# Altium project UCLA-DRS4-2.1.PrjPCB (part 8 of 10)

## Sheet MARS_GPIO_MISC.SchDoc: My title
size A3; Organization: University of California; Address1: 475 Portola Plaza; Address2: Los Angeles, CA 90095; DocumentNumber: 27; Revision: R01; SheetNumber: 27; SheetTotal: 35
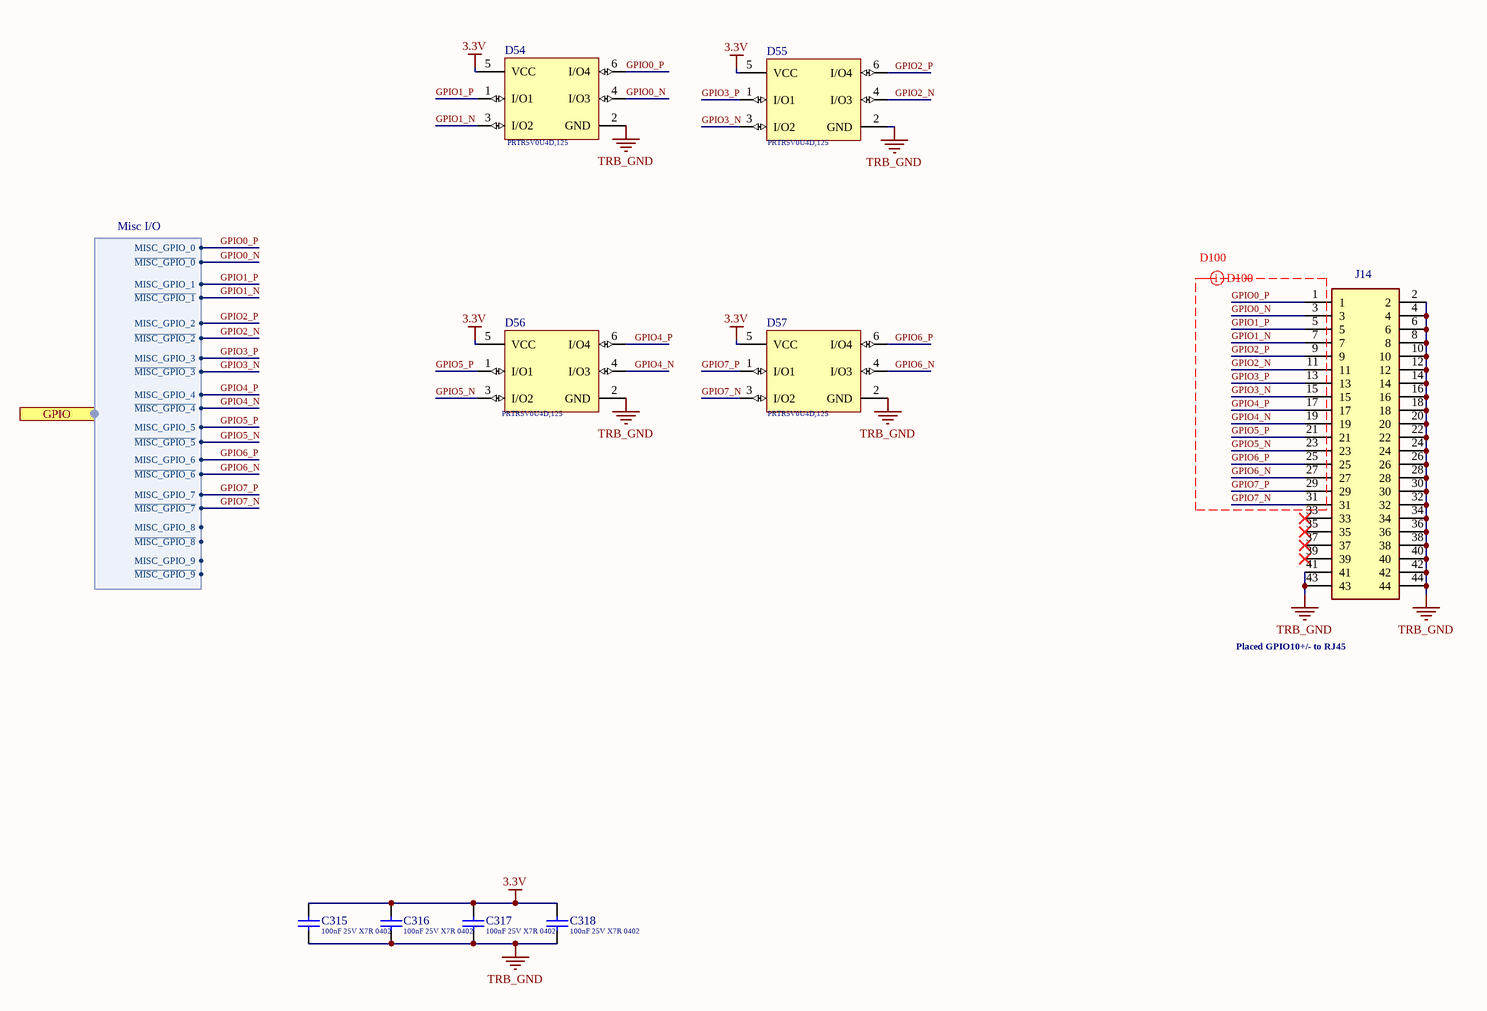
[diagram p24: MARS_GPIO_MISC.SchDoc]

### Parts
C315  Capacitance: 100nF 25V X7R 0402  [Cap_Taiyo_Yuden_TMK105B7104KV-FR_100nF]  (hidden comment: Cap_Taiyo_Yuden_TMK105B7104KV-FR_100nF)
C316  Capacitance: 100nF 25V X7R 0402  [Cap_Taiyo_Yuden_TMK105B7104KV-FR_100nF]  (hidden comment: Cap_Taiyo_Yuden_TMK105B7104KV-FR_100nF)
C317  Capacitance: 100nF 25V X7R 0402  [Cap_Taiyo_Yuden_TMK105B7104KV-FR_100nF]  (hidden comment: Cap_Taiyo_Yuden_TMK105B7104KV-FR_100nF)
C318  Capacitance: 100nF 25V X7R 0402  [Cap_Taiyo_Yuden_TMK105B7104KV-FR_100nF]  (hidden comment: Cap_Taiyo_Yuden_TMK105B7104KV-FR_100nF)
D54  PRTR5V0U4D,125  [PRTR5V0U4D,125]
D55  PRTR5V0U4D,125  [PRTR5V0U4D,125]
D56  PRTR5V0U4D,125  [PRTR5V0U4D,125]
D57  PRTR5V0U4D,125  [PRTR5V0U4D,125]
J14  10-89-7442  [HDRV44W87P254_2X22_5601X508X864P]  (value not drawn)

### Ports
GPIO (harness Misc I/O)

### Harnesses
Misc I/O: MISC_GPIO_0, ~{MISC_GPIO_0}, MISC_GPIO_1, ~{MISC_GPIO_1}, MISC_GPIO_2, ~{MISC_GPIO_2}, MISC_GPIO_3, ~{MISC_GPIO_3}, MISC_GPIO_4, ~{MISC_GPIO_4}, MISC_GPIO_5, ~{MISC_GPIO_5}, MISC_GPIO_6, ~{MISC_GPIO_6}, MISC_GPIO_7, ~{MISC_GPIO_7}, MISC_GPIO_8, ~{MISC_GPIO_8}, MISC_GPIO_9, ~{MISC_GPIO_9}

### Nets
3.3V: C315.2 C316.2 C317.2 C318.2 D54.5(VCC) D55.5(VCC) D56.5(VCC) D57.5(VCC)
TRB_GND: C315.1 C316.1 C317.1 C318.1 D54.2(GND) D55.2(GND) D56.2(GND) D57.2(GND) J14.2 J14.4 J14.6 J14.8 J14.10 J14.12 J14.14 J14.16 J14.18 J14.20 J14.22 J14.24 J14.26 J14.28 J14.30 J14.32 J14.34 J14.36 J14.38 J14.40 J14.41 J14.42 J14.43 J14.44
GPIO0_N: D54.4(I/O3) J14.3 ; port GPIO.~{MISC_GPIO_0}
GPIO0_P: D54.6(I/O4) J14.1 ; port GPIO.MISC_GPIO_0
GPIO1_N: D54.3(I/O2) J14.7 ; port GPIO.~{MISC_GPIO_1}
GPIO1_P: D54.1(I/O1) J14.5 ; port GPIO.MISC_GPIO_1
GPIO2_N: D55.4(I/O3) J14.11 ; port GPIO.~{MISC_GPIO_2}
GPIO2_P: D55.6(I/O4) J14.9 ; port GPIO.MISC_GPIO_2
GPIO3_N: D55.3(I/O2) J14.15 ; port GPIO.~{MISC_GPIO_3}
GPIO3_P: D55.1(I/O1) J14.13 ; port GPIO.MISC_GPIO_3
GPIO4_N: D56.4(I/O3) J14.19 ; port GPIO.~{MISC_GPIO_4}
GPIO4_P: D56.6(I/O4) J14.17 ; port GPIO.MISC_GPIO_4
GPIO5_N: D56.3(I/O2) J14.23 ; port GPIO.~{MISC_GPIO_5}
GPIO5_P: D56.1(I/O1) J14.21 ; port GPIO.MISC_GPIO_5
GPIO6_N: D57.4(I/O3) J14.27 ; port GPIO.~{MISC_GPIO_6}
GPIO6_P: D57.6(I/O4) J14.25 ; port GPIO.MISC_GPIO_6
GPIO7_N: D57.3(I/O2) J14.31 ; port GPIO.~{MISC_GPIO_7}
GPIO7_P: D57.1(I/O1) J14.29 ; port GPIO.MISC_GPIO_7

Not connected (* = marked no-connect by the designer): J14 33* 35* 37* 39*

### Layout directives
differential pair; differential pair class D100: GPIO0_N, GPIO0_P, GPIO1_N, GPIO1_P, GPIO2_N, GPIO2_P, GPIO3_N, GPIO3_P, GPIO4_N, GPIO4_P, GPIO5_N, GPIO5_P, GPIO6_N, GPIO6_P, GPIO7_N, GPIO7_P

### Notes on the sheet
- D100
- Placed GPIO10+/- to RJ45
- 475 Portola Plaza
- GAPS TOF
- igarcia91@g.ucla.edu
- Los Angeles, CA
- 310-825-0344
- Size:
- Date:
- Letter
- Revision:
- Time:
- Sheet
- of
- andrew.peck@cern.ch
- spq@ucla.edu
- File:

### Library data of the parts
C315-C318 = Cap_Taiyo_Yuden_TMK105B7104KV-FR_100nF: CAP CER 100nF 25V X7R 0402; Supplier 1: Mouser; Supplier Part Number 1: 963-TMK105B7104KV-FR
D54-D57 = PRTR5V0U4D,125: ESD Suppressors / TVS Diodes 5.5V QUAD R-R ESD ULTRA LOW CAP; Supplier 1: Mouser; Supplier Part Number 1: 771-PRTR5V0U4D-T/R
J14 = 10-89-7442: Connector; Manufacturer_Name: Molex; Datasheet Link: https://componentsearchengine.com//10-89-7442.pdf; Height: 8.64mm; Mouser2 Part Number: 538-10-89-7442; Mouser2 Price/Stock: https://www.mouser.com/Search/Refine.aspx?Keyword=538-10-89-7442; Manufacturer_Part_Number: 10-89-7442

## Sheet MARS_FTDI.SchDoc: My title
size A3; Organization: University of California; Address1: 475 Portola Plaza; Address2: Los Angeles, CA 90095; DocumentNumber: 18; Revision: R01; SheetNumber: 18; SheetTotal: 35
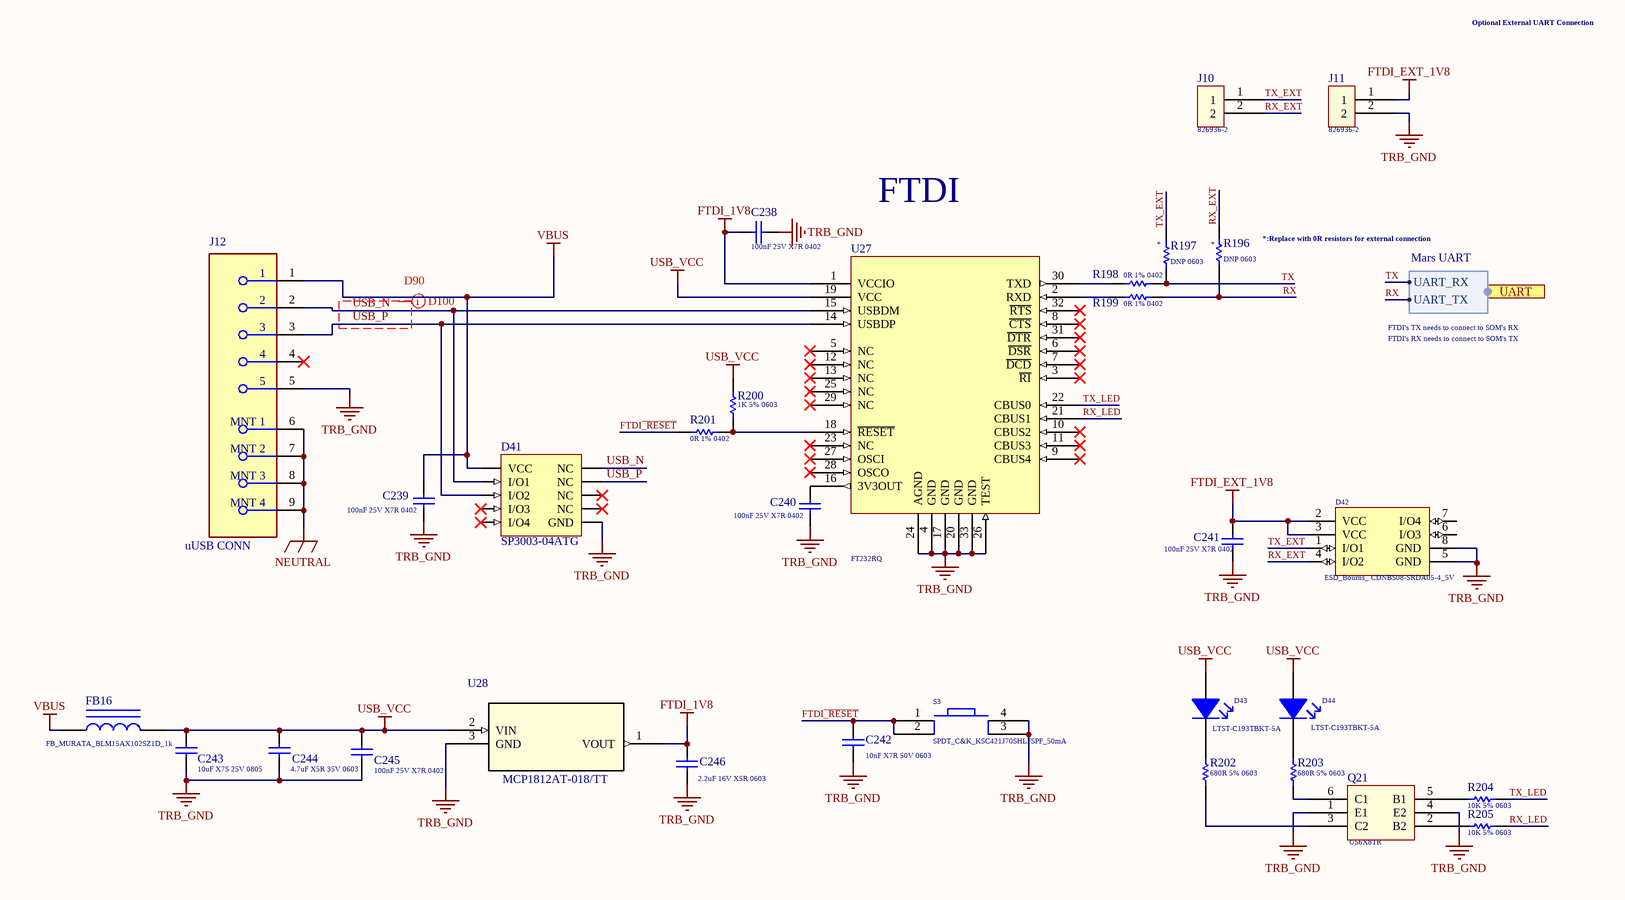
[diagram p25: MARS_FTDI.SchDoc]

### Parts
C238  Capacitance: 100nF 25V X7R 0402  [Cap_Taiyo_Yuden_TMK105B7104KV-FR_100nF]  (hidden comment: Cap_Taiyo_Yuden_TMK105B7104KV-FR_100nF)
C239  Capacitance: 100nF 25V X7R 0402  [Cap_Taiyo_Yuden_TMK105B7104KV-FR_100nF]  (hidden comment: Cap_Taiyo_Yuden_TMK105B7104KV-FR_100nF)
C240  Capacitance: 100nF 25V X7R 0402  [Cap_Taiyo_Yuden_TMK105B7104KV-FR_100nF]  (hidden comment: Cap_Taiyo_Yuden_TMK105B7104KV-FR_100nF)
C241  Capacitance: 100nF 25V X7R 0402  [Cap_Taiyo_Yuden_TMK105B7104KV-FR_100nF]  (hidden comment: Cap_Taiyo_Yuden_TMK105B7104KV-FR_100nF)
C242  Capacitance: 10nF X7R 50V 0603  [Kemet_C0603_0]  (hidden comment: Cap_Kemet_C0603C103J5RACTU_eec)
C243  Capacitance: 10uF X7S 25V 0805  [Cap_Murata_ GRM21BC71E106ME11L_10uF]  (hidden comment: Cap_Murata_ GRM21BC71E106ME11L_10uF)
C244  Capacitance: 4.7uF X5R 35V 0603  [Cap_Murata_ZRB18AR6YA475ME05L_4.7uF]  (hidden comment: Cap_Murata_ZRB18AR6YA475ME05L_4.7uF)
C245  Capacitance: 100nF 25V X7R 0402  [Cap_Taiyo_Yuden_TMK105B7104KV-FR_100nF]  (hidden comment: Cap_Taiyo_Yuden_TMK105B7104KV-FR_100nF)
C246  Capacitance: 2.2uF 16V X5R 0603  [CAPC0603(1608)100_L]  (hidden comment: Cap_Taiyo_Yuden_2.2uF)
D41  Series: SP3003-04ATG  [Diode_SP3003-04ATG_LVDS_ESD]  (hidden comment: Diode_SP3003-04ATG_LVDS_ESD)
D42  ESD_Bourns_ CDNBS08-SRDA05-4_5V  [ESD_Bourns_ CDNBS08-SRDA05-4_5V]
D43  Series: LTST-C193TBKT-5A  [Led_Lite-On_LTST-C193TBKT-5A_Blue]  (hidden comment: Led_Lite-On_LTST-C193TBKT-5A_Blue)
D44  Series: LTST-C193TBKT-5A  [Led_Lite-On_LTST-C193TBKT-5A_Blue]  (hidden comment: Led_Lite-On_LTST-C193TBKT-5A_Blue)
FB16  FB_MURATA_BLM15AX102SZ1D_1k  [FB_MURATA_BLM15AX102SZ1D_1k]
J10  Series: 826936-2  [Header_TE_Connectivity_826936-2_2POS_5A]  (hidden comment: Header_TE_Connectivity_826936-2_2POS_5A)
J11  Series: 826936-2  [Header_TE_Connectivity_826936-2_2POS_5A]  (hidden comment: Header_TE_Connectivity_826936-2_2POS_5A)
J12  uUSB CONN  [Wurth_Electronics_629105150521_MFG]
Q21  Series: US6X8TR  [BJT_ROHM_US6X8TR_1A_NPN]  (hidden comment: BJT_ROHM_US6X8TR_1A_NPN)
R196  Resistance: DNP 0603  [RES_DNP_0603]  (hidden comment: RES_DNP_0603)
R197  Resistance: DNP 0603  [RES_DNP_0603]  (hidden comment: RES_DNP_0603)
R198  Resistance: 0R 1% 0402  [Res_Vishay_CRCW04020000Z0EDC_0_Ohm]  (hidden comment: Res_Vishay_CRCW04020000Z0EDC_0_Ohm)
R199  Resistance: 0R 1% 0402  [Res_Vishay_CRCW04020000Z0EDC_0_Ohm]  (hidden comment: Res_Vishay_CRCW04020000Z0EDC_0_Ohm)
R200  1K 5% 0603  [RESC0603(1608)_L]
R201  Resistance: 0R 1% 0402  [Res_Vishay_CRCW04020000Z0EDC_0_Ohm]  (hidden comment: Res_Vishay_CRCW04020000Z0EDC_0_Ohm)
R202  680R 5% 0603  [RESC0603(1608)_L]
R203  680R 5% 0603  [RESC0603(1608)_L]
R204  10K 5% 0603  [RESC0603(1608)_L]
R205  10K 5% 0603  [RESC0603(1608)_L]
S3  SPDT_C&K_KSC421J70SHLFSPF_50mA  [SPDT_C&K_KSC421J70SHLFSPF_50mA]
U27  Series: FT232RQ  [IC_FTDI_FT232RQ-REEL]  (hidden comment: IC_FTDI_FT232RQ-REEL)
U28  MCP1812AT-018/TT  [SOT23_TT_MCH]

### Ports
UART (harness Mars UART)

### Harnesses
Mars UART: UART_RX, UART_TX

### Nets
FTDI_1V8: C238.2 C246.2 U27.1(VCCIO) U28.1(VOUT)
FTDI_EXT_1V8: C241.2 D42.2(VCC) D42.3(VCC) J11.1
NEUTRAL: J12.6(MNT_1) J12.7(MNT_2) J12.8(MNT_3) J12.9(MNT_4)
TRB_GND: C238.1 C239.1 C240.1 C241.1 C242.2 C243.2 C244.1 C245.1 C246.1 D41.8(GND) D42.5(GND) D42.8(GND) J11.2 J12.5 Q21.1(E1) Q21.4(E2) S3.3 S3.4 U27.4(GND) U27.17(GND) U27.20(GND) U27.24(AGND) U27.26(TEST) U27.33(GND) U28.3(GND)
USB_VCC: C243.1 C244.2 C245.2 D43.2(A) D44.2(A) FB16.2 R200.2 U27.19(VCC) U28.2(VIN)
VBUS: C239.2 D41.3(VCC) FB16.1 J12.1
FTDI~{_RESET}: C242.1 R201.2 S3.1 S3.2
RX: R196.2 R199.2 ; port UART.UART_TX  [project net IO_MIO47_B13_L19_U5]
RX_EXT: D42.4(I/O2) J10.2 R196.1
RX_LED: R205.1 U27.21(CBUS1)
TX: R197.2 R198.2 ; port UART.UART_RX  [project net IO_MIO46_B13_L19_T5]
TX_EXT: D42.1(I/O1) J10.1 R197.1
TX_LED: R204.2 U27.22(CBUS0)
USB_N: D41.1(I/O1) D41.10(NC) J12.2 U27.15(USBDM)
USB_P: D41.2(I/O2) D41.9(NC) J12.3 U27.14(USBDP)
NetC240_2: C240.2 U27.16(3V3OUT)
NetD43_1: D43.1(K) R202.2
NetD44_1: D44.1(K) R203.2
NetQ21_2: Q21.2(B2) R205.2
NetQ21_3: Q21.3(C2) R202.1
NetQ21_5: Q21.5(B1) R204.1
NetQ21_6: Q21.6(C1) R203.1
NetR198_1: R198.1 U27.30(TXD)
NetR199_1: R199.1 U27.2(RXD)
NetR200_1: R200.1 R201.1 U27.18(~{RESET})

Not connected (* = marked no-connect by the designer): D41 4(I/O3)* 5(I/O4)* 6(NC)* 7(NC)*; D42 6(I/O3) 7(I/O4); J12 4*; U27 3(~{RI})* 5(NC)* 6(~{DSR})* 7(~{DCD})* 8(~{CTS})* 9(CBUS4)* 10(CBUS2)* 11(CBUS3)* 12(NC)* 13(NC)* 23(NC)* 25(NC)* 27(OSCI)* 28(OSCO)* 29(NC)* 31(~{DTR})* 32(~{RTS})*

### Layout directives
differential pair; differential pair class D90: USB_N, USB_P

### Notes on the sheet
- Optional External UART Connection
- FTDI
- (near R197) *
- (near R196) *
- (near R196) *:Replace with 0R resistors for external connection
- D90
- FTDI's TX needs to connect to SOM's RX
- FTDI's RX needs to connect to SOM's TX
- 475 Portola Plaza
- GAPS TOF
- igarcia91@g.ucla.edu
- Los Angeles, CA
- 310-825-0344
- Size:
- Date:
- Letter
- Revision:
- Time:
- Sheet
- of
- andrew.peck@cern.ch
- spq@ucla.edu
- File:

### Library data of the parts
C238-C241 C245 = Cap_Taiyo_Yuden_TMK105B7104KV-FR_100nF: CAP CER 100nF 25V X7R 0402; Supplier 1: Mouser; Supplier Part Number 1: 963-TMK105B7104KV-FR
C242 = Cap_Kemet_C0603C103J5RACTU_eec: as C22 on sheet 3V_ADC_SUPPLY; Part Number: C0603C103J5RACTU; helpURL: https://upverter.com/upn/revision/8a8d0c297e33ac74/; ComponentLink2Description: Datasheet; Temperature: -55°C to +125°C; Package: C0603; Supplier 2: Mouser; Price: 0.0184203126773; Supplier 1: Digi-Key; ComponentLink1URL: https://upverter.com/upn/revision/8a8d0c297e33ac74/; Supplier Part Number 2: 80-C0603C103J5R; Supplier Part Number 1: 399-1092-1-ND; Value: 10nF; ComponentLink1Description: Upverter; ComponentLink2URL: https://content.kemet.com/datasheets/KEM_C1002_X7R_SMD.pdf; RoHS: TRUE; Mouser Part Number: 80-C0603C103J5R; Temperature Range High: +125°C; Digikey Description: CAP CER 10000PF 50V X7R 0603; Digikey Part Number: 399-1092-1-ND; Lead Free: yes; Temperature Range Low: -55°C; Voltage: 50V
C243 = Cap_Murata_ GRM21BC71E106ME11L_10uF: CAP CER 10uF 25V X7R 0805; Supplier 1: Mouser; Supplier Part Number 1: 81-GRM21BC71E106ME1L
C244 = Cap_Murata_ZRB18AR6YA475ME05L_4.7uF: CAP CER 4.7uF 35V X5R 0603; Supplier 1: Mouser; Supplier Part Number 1: 81-ZRB18AR6YA475ME5L
C246 = CMP-1035-02763-1: CAP 2.2uF 16V ±10% 0603 (1608 Metric) Thickness 1mm SMD; Case-Metric: 1608; Case-EIA: 0603; Tolerance: Â±10%; Value: 2.2uF; Max Thickness: 1 mm; Technology: SMT; Rated Voltage: 16 V; Parameter 1: *
D41 = Diode_SP3003-04ATG_LVDS_ESD: ESD Suppressors / TVS Diodes 4 Ch 8kV 0.65pF SPA; Supplier 1: Mouser; Supplier Part Number 1: 576-SP3003-04ATG
D42 = ESD_Bourns_ CDNBS08-SRDA05-4_5V: ESD Suppressors / TVS Diodes SO-8 5V 500W Low Capacitance; Supplier Part Number 1: 652-CDNBS08-SRDA05-4; Supplier 1: Mouser
D43 D44 = Led_Lite-On_LTST-C193TBKT-5A_Blue: Standard LEDs - SMD Blue 470nm 28mcd 20mA; Supplier 1: Mouser; Supplier Part Number 1: 859-LTSTC193TBKT5A
FB16 = FB_MURATA_BLM15AX102SZ1D_1k: FB SMD 1000 OHM 25% 3/4W 0402; Supplier Part Number 1: 81-BLM15AX102SZ1D; Supplier 1: Mouser
J10 J11 = Header_TE_Connectivity_826936-2_2POS_5A: Headers & Wire Housings 2P SINGLE ROW 5A; Supplier Part Number 1: 571-826936-2; Supplier 1: Mouser
J12 = 629105150521: USB Connectors WR-COM USB Micro SMT Type B Horiztl; Manufacturer 1: Wurth; Manufacturer Part Number 1: 629105150521
Q21 = BJT_ROHM_US6X8TR_1A_NPN: Bipolar Transistors - BJT NPN+NPN 30VCEO 1A SOT-363T; Manufacturer 1: ROHM; Supplier Part Number 1: 755-US6X8TR; Supplier 1: Mouser; Manufacturer Part Number 1: US6X8TR
R196 R197 = RES_DNP_0603: 0603 Do not place resistor
R198 R199 R201 = Res_Vishay_CRCW04020000Z0EDC_0_Ohm: 0R 0.062W 1% 0402 (1005 Metric)  SMD; Supplier 1: Mouser; Supplier Part Number 1: 71-CRCW04020000Z0EDC
R200 = CMP-1012-00074-1: as R24 on sheet MarsCarrier_PWR; Technology: SMT; Tolerance: 5 %; Power: 0.1 W
R202 R203 = CMP-1012-00070-1: as R23 on sheet MarsCarrier_PWR; Tolerance: 5 %; Technology: SMT; Power: 0.1 W
R204 R205 = CMP-1012-00098-1: as R34 on sheet MarsCarrier_PWR; Technology: SMT; Tolerance: 5 %; Power: 0.1 W
S3 = SPDT_C&K_KSC421J70SHLFSPF_50mA: as S1 on sheet MarsCarrier_PWR; Supplier 1: Mouser; Supplier Part Number 1: 611-KSC421J70SHLFSPF
U27 = IC_FTDI_FT232RQ-REEL: USB Interface IC USB to Serial UART Enhanced IC QFN-32; Supplier 1: Mouser; Supplier Part Number 1: 895-FT232RQ
U28 = MCP1812AT-018/TT: LDO Voltage Regulators 1.8V 3-Lead SOT-23 300mA Ultra Low Iq LDO with Auto-Discharge; Vendor: Microchip; Built_By: EMA_Cory; SourceLibrary: Microchip_2020-03-04; Datasheet: http://ww1.microchip.com/downloads/en/DeviceDoc/MCP1811A-11B-12A-12B-Data-Sheet-20006088B.pdf; Manufacturer_Part_Number: MCP1812AT-018/TT; Copyright: Copyright (C) 2018 Accelerated Designs. All rights reserved; RefDes: RefDes; Type: DEV

## Sheet DRS4_GPIO_EXPANDER_MODULE.SchDoc: My title
size A3; Organization: University of California; Address1: 475 Portola Plaza; Address2: Los Angeles, CA 90095; DocumentNumber: 16; Revision: R01; SheetNumber: 16; SheetTotal: 35
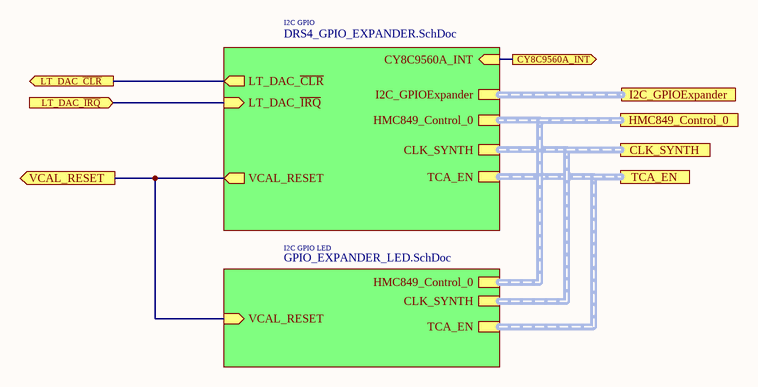
[diagram p26: DRS4_GPIO_EXPANDER_MODULE.SchDoc]

### Sub-sheets
I2C GPIO = DRS4_GPIO_EXPANDER.SchDoc: HMC849_Control_0 (harness HMC849 Control 0), I2C_GPIOExpander (harness GPIO Expander I2C), CLK_SYNTH (harness CLK SYNTH CONTROL), TCA_EN (harness TCA EN), VCAL_RESET (out), LT_DAC_~{CLR} (out), LT_DAC_~{IRQ} (in), CY8C9560A_INT (in)
I2C GPIO LED = GPIO_EXPANDER_LED.SchDoc: HMC849_Control_0 (harness HMC849 Control 0), CLK_SYNTH (harness CLK SYNTH CONTROL), TCA_EN (harness TCA EN), VCAL_RESET (in)

### Ports
CLK_SYNTH (harness CLK SYNTH CONTROL), CY8C9560A_INT (out), HMC849_Control_0 (harness HMC849 Control 0), I2C_GPIOExpander (harness GPIO Expander I2C), LT_DAC_~{CLR} (out), LT_DAC_~{IRQ} (in), TCA_EN (harness TCA EN), VCAL_RESET (out)

### Nets
DAC_~{CLR}: port LT_DAC_~{CLR}, sheet I2C GPIO/LT_DAC_~{CLR}
DAC_~{IRQ}: port LT_DAC_~{IRQ}, sheet I2C GPIO/LT_DAC_~{IRQ}
IO_B35_L15_AD12_F20_N: port CY8C9560A_INT, sheet I2C GPIO/CY8C9560A_INT
VCAL_RESET: port VCAL_RESET, sheet I2C GPIO/VCAL_RESET, sheet I2C GPIO LED/VCAL_RESET

### Buses and harness runs
harness port CLK_SYNTH = sheet I2C GPIO LED/CLK_SYNTH = sheet I2C GPIO/CLK_SYNTH
harness port HMC849_Control_0 = sheet I2C GPIO LED/HMC849_Control_0 = sheet I2C GPIO/HMC849_Control_0
harness port I2C_GPIOExpander = sheet I2C GPIO/I2C_GPIOExpander
harness port TCA_EN = sheet I2C GPIO LED/TCA_EN = sheet I2C GPIO/TCA_EN

### Notes on the sheet
- 475 Portola Plaza
- GAPS TOF
- igarcia91@g.ucla.edu
- Los Angeles, CA
- 310-825-0344
- Size:
- Date:
- Letter
- Revision:
- Time:
- Sheet
- of
- andrew.peck@cern.ch
- spq@ucla.edu
- File: